# Altium project MRTRUMAN.PrjPcb (part 1 of 4)
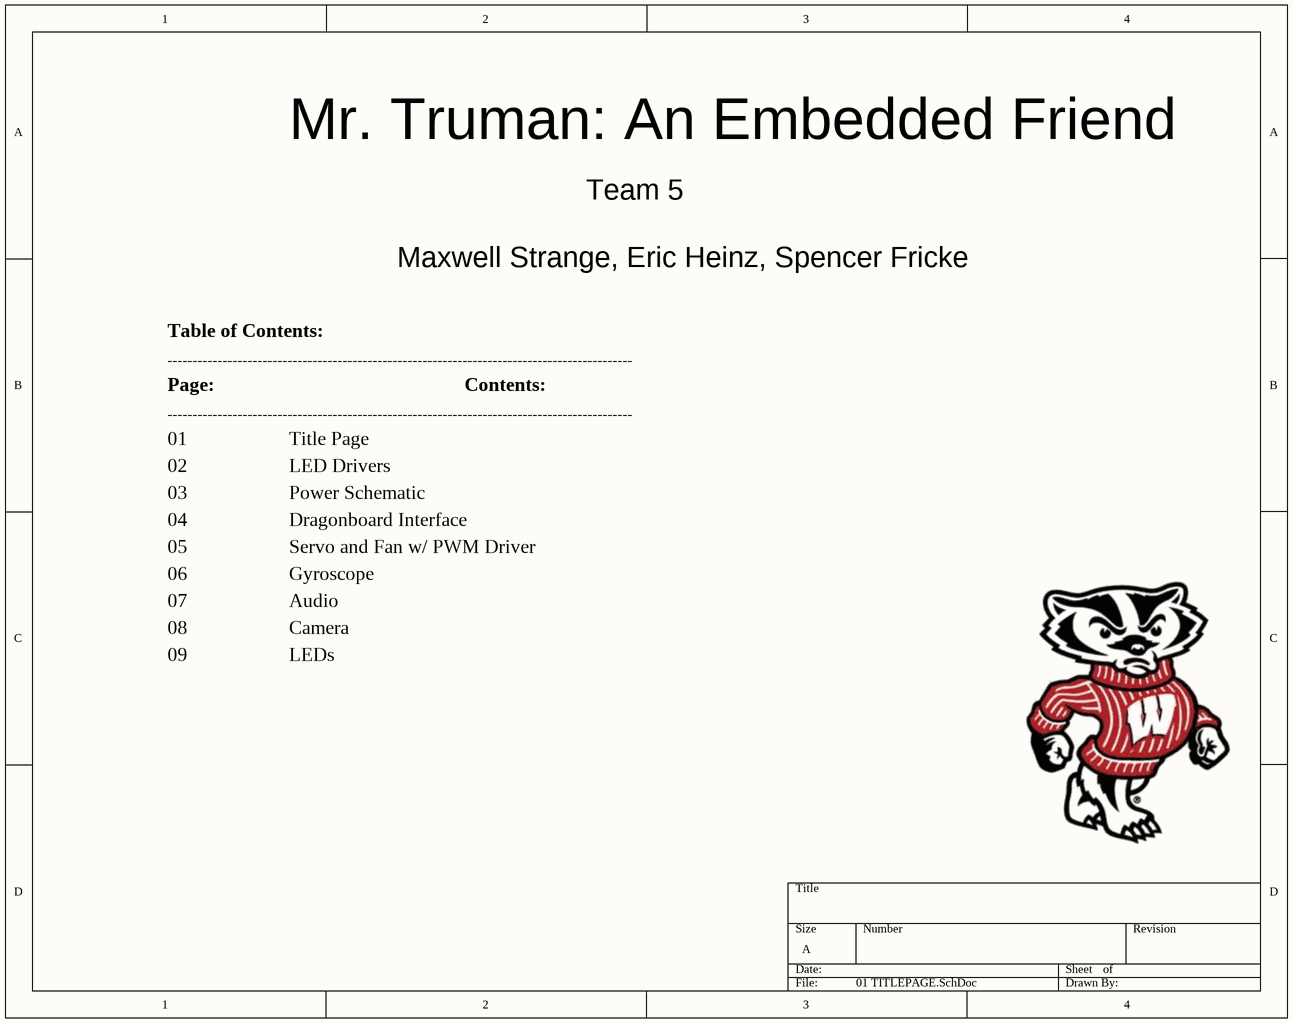
[diagram p0: 01 TITLEPAGE.SchDoc]
9 sheets, 272 parts. Net scope: global (net labels, ports and power ports of the same name join across sheets).
Board file: TRUMAN_PCB.PcbDoc
Sheets:
  01 TITLEPAGE.SchDoc
  02 LEDs.SchDoc
  03 POWER.SchDoc
  04 DragonBoard_INTF.SchDoc
  05 SERVO_FAN.SchDoc
  06 Gyro.SchDoc
  07 Audio.SchDoc
  08 Camera.SchDoc
  09 LEDs(2).SchDoc

## Sheet 01 TITLEPAGE.SchDoc: Mr. Truman ECE 453 Project
size A

### Notes on the sheet
- Mr. Truman: An Embedded Friend
- Team 5
- Maxwell Strange, Eric Heinz, Spencer Fricke
- Table of Contents:
- ---------------------------------------------------------------------------------------------
- Page:
- Contents:
- 01
- 02
- 03
- Title Page
- LED Drivers
- Power Schematic
- 04
- 05
- Dragonboard Interface
- Servo and Fan w/ PWM Driver
- 06
- 07
- 08
- Gyroscope
- Audio
- Camera
- 09
- LEDs

## Sheet 02 LEDs.SchDoc
size A
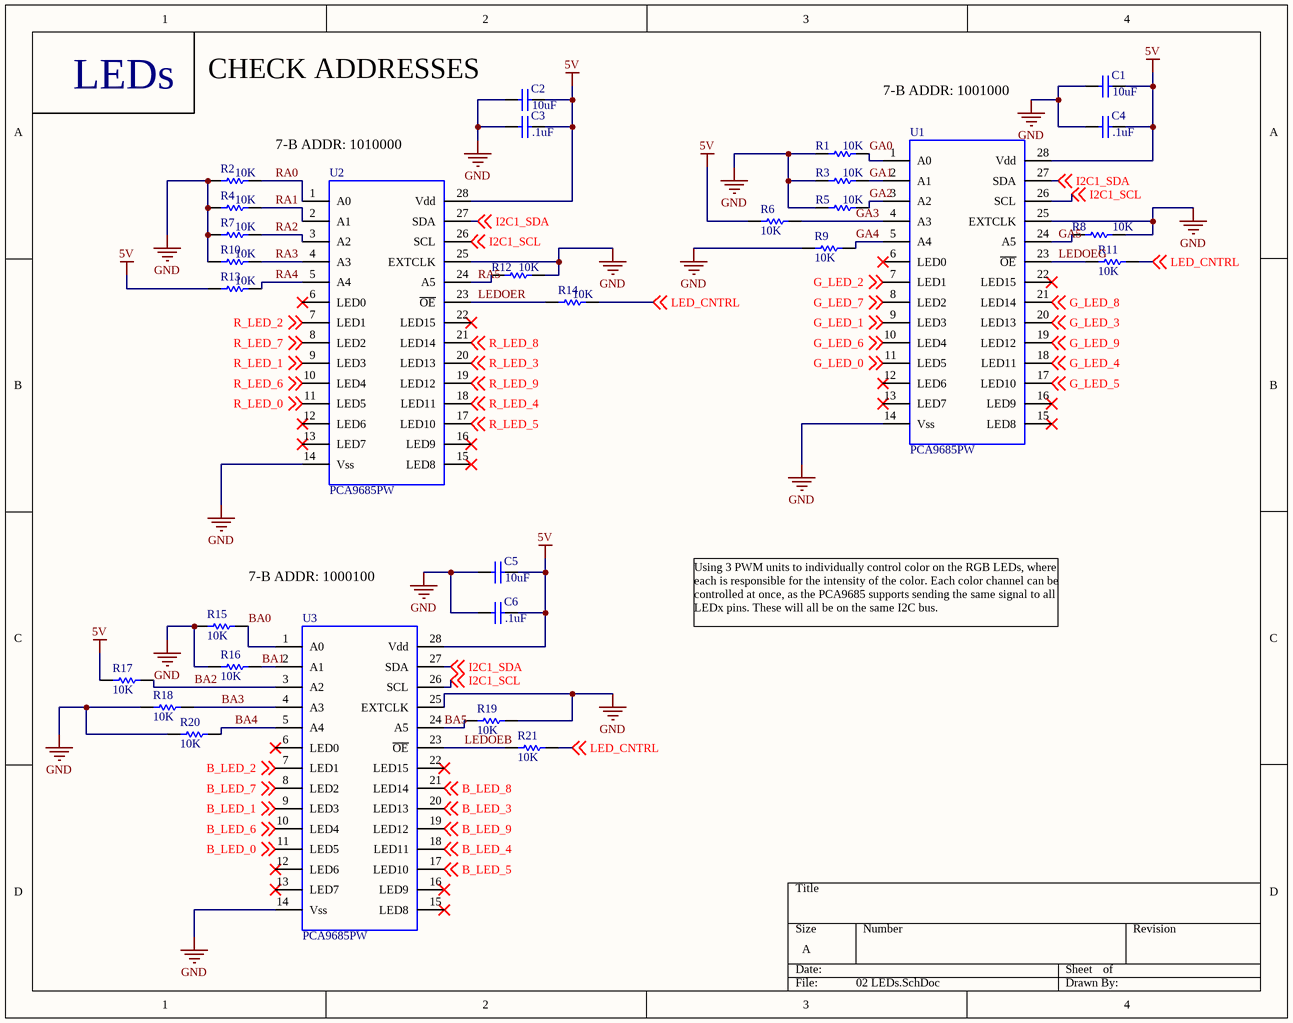
[diagram p1: 02 LEDs.SchDoc]

### Parts
C1  value 10uF  [CAPC2012X135N]  (hidden comment: CAP_0805_10u_16V)
C2  value 10uF  [CAPC2012X135N]  (hidden comment: CAP_0805_10u_16V)
C3  value .1uF  [CAPC2012X135N]  (hidden comment: CAP_0805_.1u_250V)
C4  value .1uF  [CAPC2012X135N]  (hidden comment: CAP_0805_.1u_250V)
C5  value 10uF  [CAPC2012X135N]  (hidden comment: CAP_0805_10u_16V)
C6  value .1uF  [CAPC2012X135N]  (hidden comment: CAP_0805_.1u_250V)
R1  Resistance: 10K  [RES0805]  (hidden comment: RES_0805_10K)
R2  Resistance: 10K  [RES0805]  (hidden comment: RES_0805_10K)
R3  Resistance: 10K  [RES0805]  (hidden comment: RES_0805_10K)
R4  Resistance: 10K  [RES0805]  (hidden comment: RES_0805_10K)
R5  Resistance: 10K  [RES0805]  (hidden comment: RES_0805_10K)
R6  Resistance: 10K  [RES0805]  (hidden comment: RES_0805_10K)
R7  Resistance: 10K  [RES0805]  (hidden comment: RES_0805_10K)
R8  Resistance: 10K  [RES0805]  (hidden comment: RES_0805_10K)
R9  Resistance: 10K  [RES0805]  (hidden comment: RES_0805_10K)
R10  Resistance: 10K  [RES0805]  (hidden comment: RES_0805_10K)
R11  Resistance: 10K  [RES0805]  (hidden comment: RES_0805_10K)
R12  Resistance: 10K  [RES0805]  (hidden comment: RES_0805_10K)
R13  Resistance: 10K  [RES0805]  (hidden comment: RES_0805_10K)
R14  Resistance: 10K  [RES0805]  (hidden comment: RES_0805_10K)
R15  Resistance: 10K  [RES0805]  (hidden comment: RES_0805_10K)
R16  Resistance: 10K  [RES0805]  (hidden comment: RES_0805_10K)
R17  Resistance: 10K  [RES0805]  (hidden comment: RES_0805_10K)
R18  Resistance: 10K  [RES0805]  (hidden comment: RES_0805_10K)
R19  Resistance: 10K  [RES0805]  (hidden comment: RES_0805_10K)
R20  Resistance: 10K  [RES0805]  (hidden comment: RES_0805_10K)
R21  Resistance: 10K  [RES0805]  (hidden comment: RES_0805_10K)
U1  PCA9685PW  [TSSOP28]
U2  PCA9685PW  [TSSOP28]
U3  PCA9685PW  [TSSOP28]

### Nets
5V: C1.2 C2.2 C3.2 C4.2 C5.2 C6.2 R6.1 R13.1 R17.1 U1.28(Vdd) U2.28(Vdd) U3.28(Vdd)
GND: C1.1 C2.1 C3.1 C4.1 C5.1 C6.1 R1.1 R2.1 R3.1 R4.1 R5.1 R7.1 R8.2 R9.1 R10.1 R12.2 R15.1 R16.1 R18.1 R19.2 R20.1 U1.14(Vss) U1.25(EXTCLK) U2.14(Vss) U2.25(EXTCLK) U3.14(Vss) U3.25(EXTCLK)
B_LED_0: U3.11(LED5) ; off-sheet B_LED_0
B_LED_1: U3.9(LED3) ; off-sheet B_LED_1
B_LED_2: U3.7(LED1) ; off-sheet B_LED_2
B_LED_3: U3.20(LED13) ; off-sheet B_LED_3
B_LED_4: U3.18(LED11) ; off-sheet B_LED_4
B_LED_5: U3.17(LED10) ; off-sheet B_LED_5
B_LED_6: U3.10(LED4) ; off-sheet B_LED_6
B_LED_7: U3.8(LED2) ; off-sheet B_LED_7
B_LED_8: U3.21(LED14) ; off-sheet B_LED_8
B_LED_9: U3.19(LED12) ; off-sheet B_LED_9
BA0: R15.2 U3.1(A0)
BA1: R16.2 U3.2(A1)
BA2: R17.2 U3.3(A2)
BA3: R18.2 U3.4(A3)
BA4: R20.2 U3.5(A4)
BA5: R19.1 U3.24(A5)
G_LED_0: U1.11(LED5) ; off-sheet G_LED_0
G_LED_1: U1.9(LED3) ; off-sheet G_LED_1
G_LED_2: U1.7(LED1) ; off-sheet G_LED_2
G_LED_3: U1.20(LED13) ; off-sheet G_LED_3
G_LED_4: U1.18(LED11) ; off-sheet G_LED_4
G_LED_5: U1.17(LED10) ; off-sheet G_LED_5
G_LED_6: U1.10(LED4) ; off-sheet G_LED_6
G_LED_7: U1.8(LED2) ; off-sheet G_LED_7
G_LED_8: U1.21(LED14) ; off-sheet G_LED_8
G_LED_9: U1.19(LED12) ; off-sheet G_LED_9
GA0: R1.2 U1.1(A0)
GA1: R3.2 U1.2(A1)
GA2: R5.2 U1.3(A2)
GA3: R6.2 U1.4(A3)
GA4: R9.2 U1.5(A4)
GA5: R8.1 U1.24(A5)
I2C1_SCL: U1.26(SCL) U2.26(SCL) U3.26(SCL) ; off-sheet I2C1_SCL
I2C1_SDA: U1.27(SDA) U2.27(SDA) U3.27(SDA) ; off-sheet I2C1_SDA
LED_CNTRL: R11.2 R14.2 R21.2 ; off-sheet LED_CNTRL
LEDOEB: R21.1 U3.23(~{OE})
LEDOEG: R11.1 U1.23(~{OE})
LEDOER: R14.1 U2.23(~{OE})
R_LED_0: U2.11(LED5) ; off-sheet R_LED_0
R_LED_1: U2.9(LED3) ; off-sheet R_LED_1
R_LED_2: U2.7(LED1) ; off-sheet R_LED_2
R_LED_3: U2.20(LED13) ; off-sheet R_LED_3
R_LED_4: U2.18(LED11) ; off-sheet R_LED_4
R_LED_5: U2.17(LED10) ; off-sheet R_LED_5
R_LED_6: U2.10(LED4) ; off-sheet R_LED_6
R_LED_7: U2.8(LED2) ; off-sheet R_LED_7
R_LED_8: U2.21(LED14) ; off-sheet R_LED_8
R_LED_9: U2.19(LED12) ; off-sheet R_LED_9
RA0: R2.2 U2.1(A0)
RA1: R4.2 U2.2(A1)
RA2: R7.2 U2.3(A2)
RA3: R10.2 U2.4(A3)
RA4: R13.2 U2.5(A4)
RA5: R12.1 U2.24(A5)

Not connected (* = marked no-connect by the designer): U1 6(LED0)* 12(LED6)* 13(LED7)* 15(LED8)* 16(LED9)* 22(LED15)*; U2 6(LED0)* 12(LED6)* 13(LED7)* 15(LED8)* 16(LED9)* 22(LED15)*; U3 6(LED0)* 12(LED6)* 13(LED7)* 15(LED8)* 16(LED9)* 22(LED15)*

### Notes on the sheet
- LEDs
- CHECK ADDRESSES
- 7-B ADDR: 1001000
- 7-B ADDR: 1010000
- 7-B ADDR: 1000100
- Using 3 PWM units to individually control color on the RGB LEDs, where each is responsible for the intensity of the color. Each color channel can be controlled at once, as the PCA9685 supports sending the same signal to all LEDx pins. These will all be on the same I2C bus.

### Library data of the parts
C1 C2 C5 = CAP_0805_10u_16V: Cap Ceramic 10uF 16V X5R 10% SMD 0805 85C T/R; Manufacturer: Johanson Dielectrics; Manufacturer Part Number: 160R15X106KV4E; Supplier 1: Digi-Key; Supplier Part Number 1: 709-1229-1-ND; Stock 1: 36636; Pricing 1: 1=0.55, 10=0.387, 100=0.2552, 500=0.189, 1000=0.1607 (USD); Mount: Surface Mount; Case/Package: 0805; Number of Pins: 2; Weight: 0.000194oz; Case Code (Imperial): 0805; Case Code (Metric): 2012; Min Operating Temperature: -55°C; Max Operating Temperature: 85°C; Voltage Rating: 16V; Capacitance: 10uF; Voltage Rating (DC): 16V; Tolerance: 10%; Packaging: Tape and Reel; Package Quantity: 2000; Dielectric: X5R; Termination: SMD/SMT; Length: 2.03mm; Height: 1.27mm; Width: 1.27mm; Thickness: 0.06inch; Depth: 1.27mm; Radiation Hardening: No; REACH SVHC: No SVHC; ComponentLink1URL: https://datasheet.ciiva.com/26948/getdatasheetpartid-132904-26948555.pdf; ComponentLink1Description: https://datasheet.ciiva.com/26948/getdatasheetpartid-132904-26948555.pdf
C3 C4 C6 = CAP_0805_.1u_250V: Cap Ceramic 0.1uF 250V X7T 10% SMD 0805 125C Plastic T/R; Manufacturer: TDK; Manufacturer Part Number: C2012X7T2E104K125AE; Capacitance: 100nF; Supplier 1: Digi-Key; Supplier Part Number 1: 445-8883-1-ND; Stock 1: 30376; Pricing 1: 1=0.37, 10=0.25, 100=0.1419, 500=0.1002, 1000=0.0877 (USD); Case/Package: 0805; Weight: 0.000194oz; Case Code (Metric): 2012; Case Code (Imperial): 0805; Min Operating Temperature: -55°C; Max Operating Temperature: 125°C; Package Quantity: 1; Voltage Rating: 250V; Tolerance: 10%; Packaging: Tape and Reel; Voltage Rating (DC): 250V; Dielectric: X7T; Termination: SMD/SMT; Composition: Ceramic; Length: 2mm; Height: 1.25mm; Width: 0.05inch; Thickness: 0.049inch; Depth: 1.25mm; REACH SVHC: No SVHC; ComponentLink1URL: https://datasheet.ciiva.com/24219/c2012x7t2e104k125ae-265154-24219519.pdf; ComponentLink1Description: https://datasheet.ciiva.com/24219/c2012x7t2e104k125ae-265154-24219519.pdf
R1-R21 = RES_0805_10K: RES, THICK FILM, 10K, 5%, 0.125W, 0805; Manufacturer: Yageo; Manufacturer Part Number: RC0805JR-0710KL; Power Rating: 125mW; Voltage Rating: 150V; Temperature Coefficient: 100ppm/°C; Supplier 1: Digi-Key; Stock 1: 1285290; Pricing 1: 1=0.1, 10=0.019, 100=0.0076, 1000=0.0034, 2500=0.003 (USD); Case/Package: 0805; Case Code (Imperial): 0805; Case Code (Metric): 2012; Contact Plating: Tin,Matte; Min Operating Temperature: -55°C; Max Operating Temperature: 155°C; Tolerance: 5%; Packaging: Tape and Reel; Termination: SMD/SMT; Composition: Thick Film; Military Standard: Not; Length: 2mm; Height: 0.5mm; Depth: 1.25mm; Width: 1.25mm; Radiation Hardening: No; REACH SVHC: Unknown; Lead Free: Lead Free; ComponentLink1URL: https://datasheet.ciiva.com/7983/444164-7983765.pdf; ComponentLink1Description: https://datasheet.ciiva.com/7983/444164-7983765.pdf; ComponentLink2URL: https://datasheet.ciiva.com/7941/444164-7941870.pdf; ComponentLink2Description: https://datasheet.ciiva.com/7941/444164-7941870.pdf; ComponentLink3URL: https://datasheet.ciiva.com/7941/444164-7941871.pdf; ComponentLink3Description: https://datasheet.ciiva.com/7941/444164-7941871.pdf; Supplier Part Number 1: 311-10KARCT-ND
U1-U3 = PCA9685PW: IC LED DRIVER RGBA 28-TSSOP; Manufacturer: NXP Semiconductors; Manufacturer Part Number: PCA9685PW,118; Number of Outputs: 16; Frequency: 1MHz; Max Supply Voltage: 5.5V; Min Supply Voltage: 2.3V; Nominal Supply Current: 10A; Output Current per Channel: 25mA; High Level Output Current: 10mA; Low Level Output Current: 400A; Power Dissipation: 400W; Supplier 1: Digi-Key; Stock 1: 2599; Pricing 1: 1=2.31, 10=2.074, 100=1.6674, 500=1.3699, 1000=1.1351 (USD); Mount: Surface Mount; Case/Package: TSSOP; Number of Pins: 28; Min Operating Temperature: -40°C; Max Operating Temperature: 85°C; Packaging: Tape and Reel; Package Quantity: 2500; Output Voltage: 5.5V; Radiation Hardening: No; Lead Free: Lead Free; ComponentLink1URL: https://datasheet.ciiva.com/1947/pca9685-1947062.pdf; ComponentLink1Description: https://datasheet.ciiva.com/1947/pca9685-1947062.pdf; ComponentLink2URL: https://datasheet.ciiva.com/15134/getdatasheetpartid-103066-15134201.pdf; ComponentLink2Description: https://datasheet.ciiva.com/15134/getdatasheetpartid-103066-15134201.pdf; ComponentLink3URL: https://datasheet.ciiva.com/8125/pca9685-8125357.pdf; ComponentLink3Description: https://datasheet.ciiva.com/8125/pca9685-8125357.pdf; Supplier Part Number 1: 568-11925-1-ND